# Altium schematic sheet SCH-Power.SchDoc
size A4
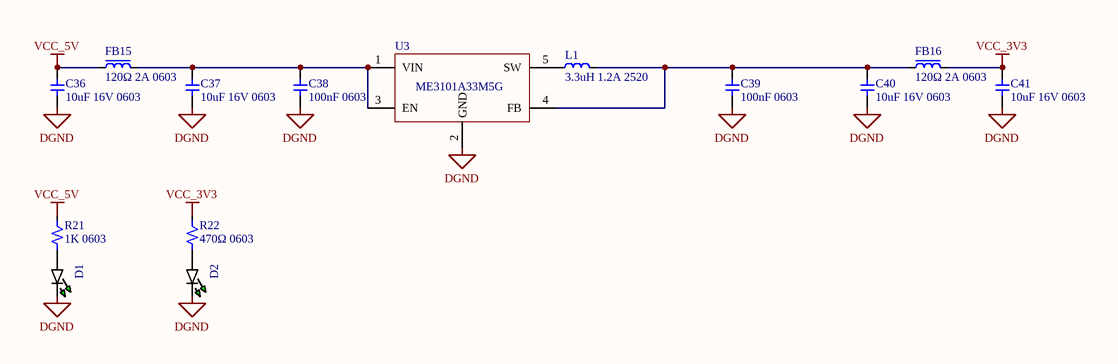
[diagram p0: SCH-Power.SchDoc]

## Parts
C36  10uF 16V 0603  [CAPC1608X08 (0603)]
C37  10uF 16V 0603  [CAPC1608X08 (0603)]
C38  100nF 0603  [CAPC1608X08 (0603)]
C39  100nF 0603  [CAPC1608X08 (0603)]
C40  10uF 16V 0603  [CAPC1608X08 (0603)]
C41  10uF 16V 0603  [CAPC1608X08 (0603)]
D1  GR/0603  [DIOC1608X06N-(0603)]  (value not drawn)
D2  GR/0603  [DIOC1608X06N-(0603)]  (value not drawn)
FB15  120Ω 2A 0603  [INDC1608X08 (0603)]
FB16  120Ω 2A 0603  [INDC1608X08 (0603)]
L1  3.3uH 1.2A 2520  [INDC2520X10N-(2520)]
R21  1K 0603  [RESC1608X04 (0603)]
R22  470Ω 0603  [RESC1608X04 (0603)]
U3  ME3101A33M5G  [SOT95P280X145-5N]

## Nets
DGND: C36.2 C37.2 C38.2 C39.2 C40.2 C41.2 D1.1(A) D2.1(A) U3.2(GND)
VCC_3V3: C41.1 FB16.2 R22.2
VCC_5V: C36.1 FB15.1 R21.2
NetC37_1: C37.1 C38.1 FB15.2 U3.1(VIN) U3.3(EN)
NetC39_1: C39.1 C40.1 FB16.1 L1.2 U3.4(FB)
NetD1_2: D1.2(K) R21.1
NetD2_2: D2.2(K) R22.1
NetL1_1: L1.1 U3.5(SW)

## Library data of the parts
C36 C37 C40 C41 = 10uF 16V 0603: 贴片MLCC电容 10uF 16V X5R 20% 0603; 1st Manufacturer: YAGEO; 1st PartNumber: CC0603KRX5R7BB106; ERP_ID: 12A20110
C38 C39 = 100nF 0603: 贴片MLCC电容 100nF 50V X7R 10% 0603; 1st Manufacturer: Yageo; 1st PartNumber: CC0603KRX7R9BB104; 2nd Manufacturer: TDK; 2nd PartNumber: CGA3E2X7R1H104K080AA; ERP_ID: 12A20039
D1 D2 = GR/0603: 标准LED-SMD Green Clear 569nm; 1st Manufacturer: LiteON; 1st PartNumber: LTST-C190GKT; 2nd Manufacturer: 可国产替代; ERP_ID: 14A10005; 2nd PartNumber: 可国产替代
FB15 FB16 = 120Ω@100MHz 2A 0603: 电源线磁珠 0603 120Ω@100MHz 2A; 1st PartNumber: PZ1608U121-2R0TF; 1st Manufacturer: 顺络; 2nd Manufacturer: Murata; 2nd PartNumber: BLM18PG121SN1D; ERP_ID: 12A40009
L1 = 3.3uH 1.2A 2520: 叠片电感 2520 3.3uH 1.2A ±20%; 1st Manufacturer: 顺络; 1st PartNumber: MPL2520S3R3MHT; ERP_ID: 12A30021
R21 = 1K 0603: 贴片厚膜电阻 1kΩ 1% 0603; 1st Manufacturer: Yageo; 1st PartNumber: RC0603FR-071KL; 2nd Manufacturer: Bourns; 2nd PartNumber: CR0603-FX-1001ELF; ERP_ID: 12A10007
R22 = 470Ω 0603: 贴片厚膜电阻 470Ω 1% 0603; 1st Manufacturer: Yageo; 1st PartNumber: RC0603FR-07470RL; 2nd Manufacturer: Bourns; 2nd PartNumber: CR0603-FX-4700ELF; ERP_ID: 12A10103
U3 = ME3101A33M5G: 6.5Vin, 3.3Vout, 500mA 同步降压转换器; 1st Manufacturer: 南京微盟; 2nd Manufacturer: TI; 2nd PartNumber: LM3671MFX-3.3/NOPB; ERP_ID: 11B20002; 1st PartNumber: ME3101A33M5G